# EAGLE design Test (EAGLE 7.3.0)
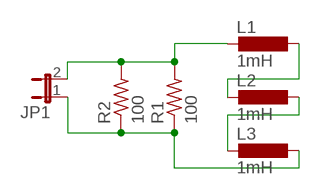
[diagram p0: schematic, sheet 1]

## Parts
JP1  JP1E  [JP1]
L1  1mH  DO3316P  [DO3316P]
L2  1mH  DO3316P  [DO3316P]
L3  1mH  DO3316P  [DO3316P]
R1  100  R-US_R0603  [R0603]
R2  100  R-US_R0603  [R0603]

## Nets
N$1: L1.2 L2.1
N$2: L2.2 L3.1
N$3: JP1.1 L3.2 R1.1 R2.1
N$4: JP1.2 L1.1 R1.2 R2.2

## Library data of the parts
JP1 = jumper:JP1E: JUMPER
L1-L3 = inductor-coilcraft:DO3316P: COILCRAFT; OC_FARNELL: unknown; OC_NEWARK: unknown
R1 R2 = rcl:R-US_: RESISTOR, American symbol

## Board
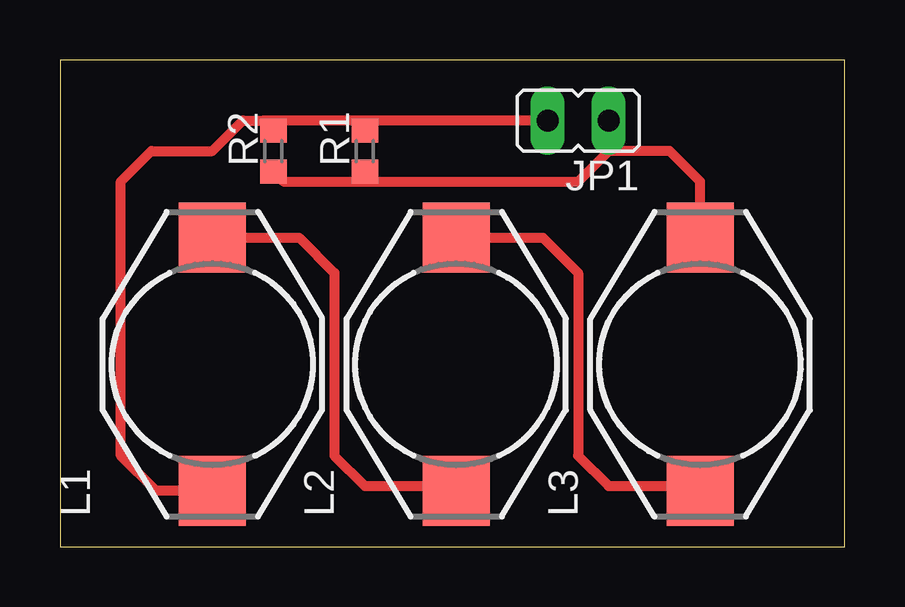
[diagram p1: board, top side]

Size 32.69 x 20.31 mm. Coordinates in mm from the lower left corner, seen from the top.
Outline: 0,0 32.69,0 32.69,20.31 0,20.31 0,0
Copper layers (1*16): Top 0.035mm / dielectric 1.5mm / Bottom 0.035mm
Design rules "default": minimum track width 10mil, minimum drill 24mil, track to track 8mil, track to pad 8mil, pad to pad 8mil, via to via 8mil, smd to smd 8mil, copper to edge 40mil, drill to drill 8mil, minimum pad ring 10mil, minimum via ring 8mil, stop-mask expansion 4mil, vias tented up to drill 0mil, thermal gap 10mil

### Footprints (pad centres in the part's own frame; a part is rotated, then mirrored left to right if it is on the bottom)
JP1 = drill 0.914 long: 1 0,-1.27; 2 0,1.27
DO3316P = smd 2.92 x 2.79: 1 -5.28,0; 2 5.28,0
R0603 = smd 1 x 1.1: 1 -0.85,0; 2 0.85,0

### Placement (x,y rotation side)
JP1  21.59,17.78 90 top
L1  6.35,7.62 90 top
L2  16.51,7.62 90 top
L3  26.67,7.62 90 top
R1  12.7,16.51 90 top
R2  8.89,16.51 90 top

### Tracks (layer width: path | path; a pad name or v marks a point on that pad's centre or on a via)
N$1
  Top 0.406: L1.2 9.96,12.9 11.43,11.43 11.43,3.81 12.7,2.54 16.31,2.54 L2.1
N$2
  Top 0.406: L2.2 20.12,12.9 21.59,11.43 21.59,3.81 22.86,2.54 26.47,2.54 L3.1
N$3
  Top 0.406: L3.2 26.67,15.24 25.4,16.51 22.86,16.51 | 12.7,15.24 9.31,15.24 R2.1 | 12.7,15.24 21.59,15.24 22.86,16.51 | 22.86,16.51 JP1.1 | R1.1 12.7,15.24
N$4
  Top 0.406: L1.1 4.01,2.34 2.54,3.81 2.54,15.24 3.81,16.51 6.35,16.51 7.62,17.78 8.47,17.78 | JP1.2 12.7,17.78 | 12.7,17.78 8.47,17.78 | 8.47,17.78 R2.2 | R1.2 12.7,17.78